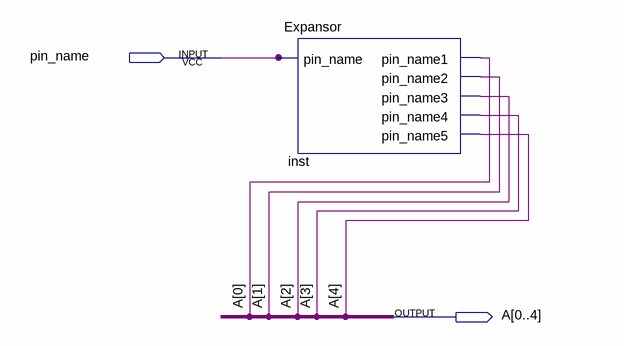
[diagram p0: schematic sheet]
// Quartus schematic teste.bdf as structural Verilog: 1 symbols, 2 pins
module teste (
  input  pin_name,
  output [0:4] A
);

  Expansor inst (
    .pin_name(pin_name), .pin_name1(A[0]), .pin_name2(A[1]), .pin_name3(A[2]), .pin_name4(A[3]),
    .pin_name5(A[4]));
endmodule
